# EAGLE design SSR 3.3V (EAGLE 7.2.0)
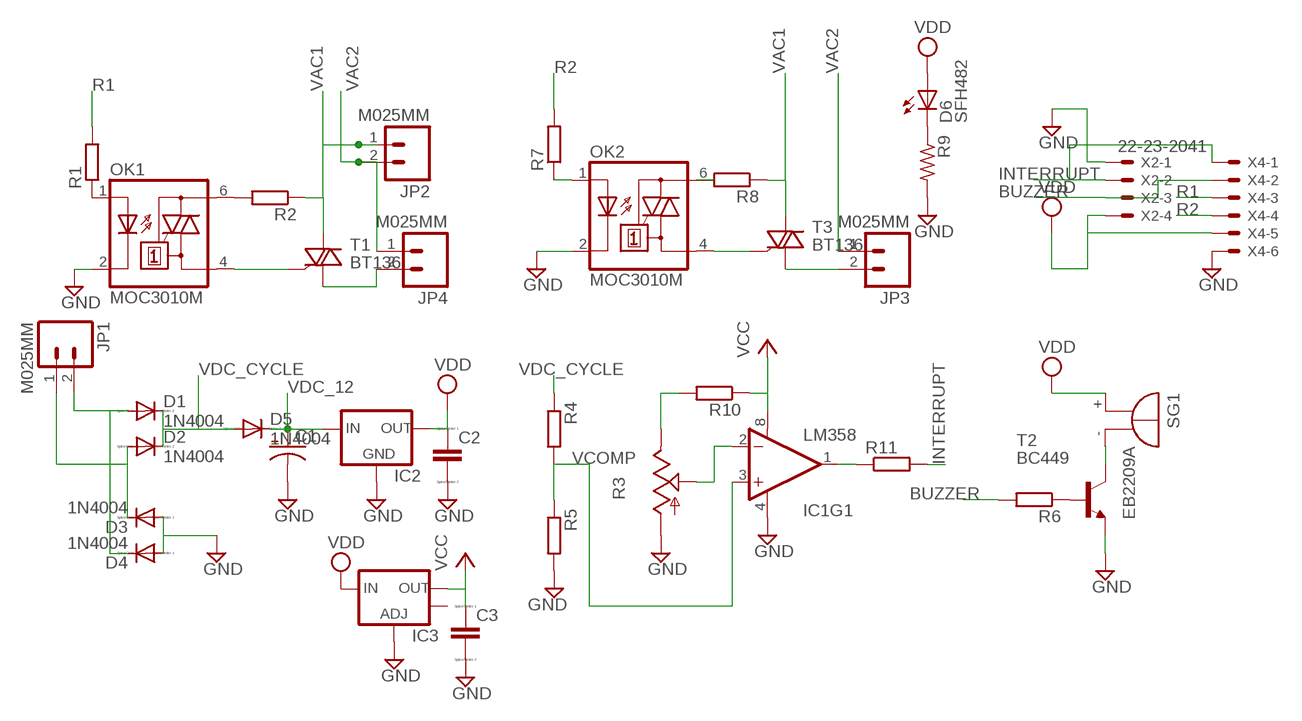
[diagram p0: schematic, sheet 1]

## Parts
C1  CPOL-USE3.5-10  [E3,5-10]
C2  CC1206  [C1206]
C3  CC1206  [C1206]
D1  1N4004  [DO41-10]
D2  1N4004  [DO41-10]
D3  1N4004  [DO41-10]
D4  1N4004  [DO41-10]
D5  1N4004  [DO41-10]
D6  SFH482  [SFH482]
IC1  LM358  [DIP08]
IC2  V_REG_78XX-TO-220  [TO-220-ALT]
IC3  V_REG_LM1117SOT223  [SOT223]
JP1  M025MM  [SCREWTERMINAL-5MM-2]
JP2  M025MM  [SCREWTERMINAL-5MM-2]
JP3  M025MM  [SCREWTERMINAL-5MM-2]
JP4  M025MM  [SCREWTERMINAL-5MM-2]
OK1  MOC3010M  [DIL06]
OK2  MOC3010M  [DIL06]
R1  R-EU_0204/7  [0204/7]
R2  R-EU_0204/7  [0204/7]
R3  TRIM_US-CA9V  [CA9V]
R4  R-EU_0207/12  [0207/12]
R5  R-EU_0204/7  [0204/7]
R6  R-EU_0204/7  [0204/7]
R7  R-EU_0204/7  [0204/7]
R8  R-EU_0204/7  [0204/7]
R9  R-US_0207/10  [0207/10]
R10  R-EU_0204/7  [0204/7]
R11  R-EU_0207/12  [0207/12]
SG1  EB2209A  [EB2209A]
T1  BT136  [TO220AB]
T2  BC449  [TO92-EBC]
T3  BT136  [TO220AB]
X2  22-23-2041  [22-23-2041]
X4  22-23-2061  [22-23-2061]

## Nets
BUZZER: R6.2 X2.3 X4.2
GND: C1.- C2.2 C3.2 D3.A D4.A IC1.4(V-) IC2.GND IC3.1(ADJ) OK1.2(C) OK2.2(C) R3.A R5.2 R9.2 T2.E X2.1 X4.6
INTERRUPT: R11.2 X2.2 X4.1
N$1: OK1.1(A) R1.1
N$2: R3.E R10.2
N$3: IC1.1(OUT) R11.1
N$4: OK1.6(A2) R2.2
N$5: IC1.2(-IN) R3.S
N$6: OK1.4(A1) T1.3(G)
N$7: R6.1 T2.B
N$8: JP4.2 T1.1(A1)
N$9: SG1.- T2.C
N$10: D6.K(C) R9.1
N$11: OK2.1(A) R7.1
N$13: OK2.6(A2) R8.2
N$14: OK2.4(A1) T3.3(G)
N$15: JP3.2 T3.1(A1)
R1: R1.2 X4.3
R2: R7.2 X4.4
VAC: D1.A D4.C JP1.2
VAC1: JP2.1 R2.1 R8.1 T1.2(A2) T3.2(A2)
VAC2: JP2.2 JP3.1 JP4.1
VAC_: D2.A D3.C JP1.1
VCC: C3.1 IC1.8(V+) IC3.2(OUT) R10.1
VCOMP: IC1.3(+IN) R4.2 R5.1
VDC_12: C1.+ D5.C IC2.IN
VDC_CYCLE: D1.C D2.C D5.A R4.1
VDD: C2.1 D6.A IC2.OUT IC3.3(IN) SG1.+ X2.4 X4.5
Unconnected: IC1.5(+IN) IC1.6(-IN) IC1.7(OUT) IC3.4(OUT)

## Library data of the parts
C1 = rcl:CPOL-US: POLARIZED CAPACITOR, American symbol
C2 C3 = eagle-ltspice:C: CAPACITOR, European symbol; SPICEMODEL: NONE; SPICEPREFIX: C
D1-D5 = diode:1N4004: DIODE general purpose rectifier, 1 A
D6 = led:SFH482: IR LED infrared emitting diode, Infineon
IC1 = SparkFun-AnalogIC:LM358: Jellybean op-amp; PROD_ID: IC-09172
IC2 = SparkFun-PowerIC:V_REG_78XX: Voltage Regulator Standard 7805 5V regulator. IGO (Input Ground Output). Spark Fun Electronics SKU : COM-00107
IC3 = SparkFun-PowerIC:V_REG_LM1117: Voltage Regulator LM1117 Standard adjustable voltage regulator but in SMD form. Spark Fun Electronics SKU : COM-00595
JP1-JP4 = SparkFun-Connectors:M02: Standard 2-pin 0.1" header. Use with - straight break away headers ( PRT-00116) - right angle break away headers (PRT-00553) - swiss pins (PRT-00743) - machine pins (PRT-00117) - female headers (PRT-00115) Molex polarized connector foot print use with: PRT-08233 with associated crimp pins and housings. 2.54_SCREWTERM for use with PRT-10571. 3.5mm Screw Terminal footprints for PRT-08084 5mm Screw Terminal footprints for use with PRT-08433
OK1 OK2 = optocoupler:MOC30*M: RANDOM-PHASE OPTOISOLATORS TRIAC DRIVER OUTPUT Source: http://www.fairchildsemi.com MOC3020-M.pdf; MF: FAIRCHILD SEMICONDUCTOR; MPN: MOC3010-M; OC_FARNELL: 1505423; OC_NEWARK: 72K8892
R1 R2 R4-R8 R10 R11 = rcl:R-EU_: RESISTOR, European symbol
R3 = pot:TRIM_US-: POTENTIOMETER
R9 = resistor:R-US_: RESISTOR, American symbol
SG1 = buzzer:EB2209A: BUZZER Source: Buerklin; OC_FARNELL: unknown; OC_NEWARK: unknown
T1 T3 = triac:BT136: Triac BT136 series E sensitive gate Source: http://www.nxp.com/acrobat_download/datasheets/BT136_SERIES_E_2.pdf
T2 = transistor-npn:BC449*: NPN Transistor
X2 = con-molex:22-23-2041: .100" (2.54mm) Center Header - 4 Pin; MF: MOLEX; MPN: 22-23-2041; OC_FARNELL: 1462920; OC_NEWARK: 38C0355
X4 = con-molex:22-23-2061: .100" (2.54mm) Center Header - 6 Pin; MF: MOLEX; MPN: 22-23-2061; OC_FARNELL: 1462922; OC_NEWARK: 27C1933

## Board
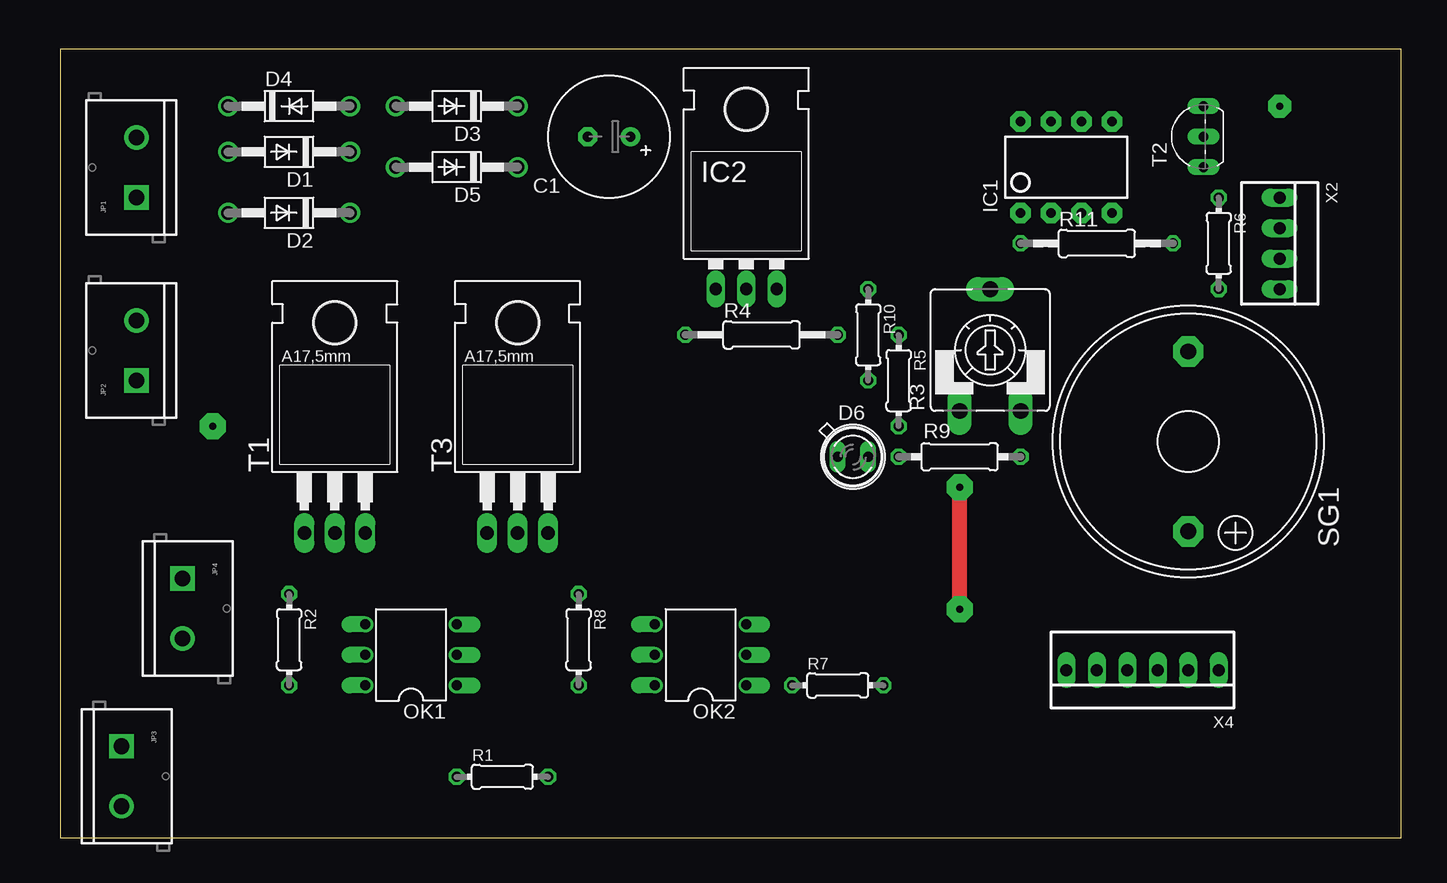
[diagram p1: board, top side]
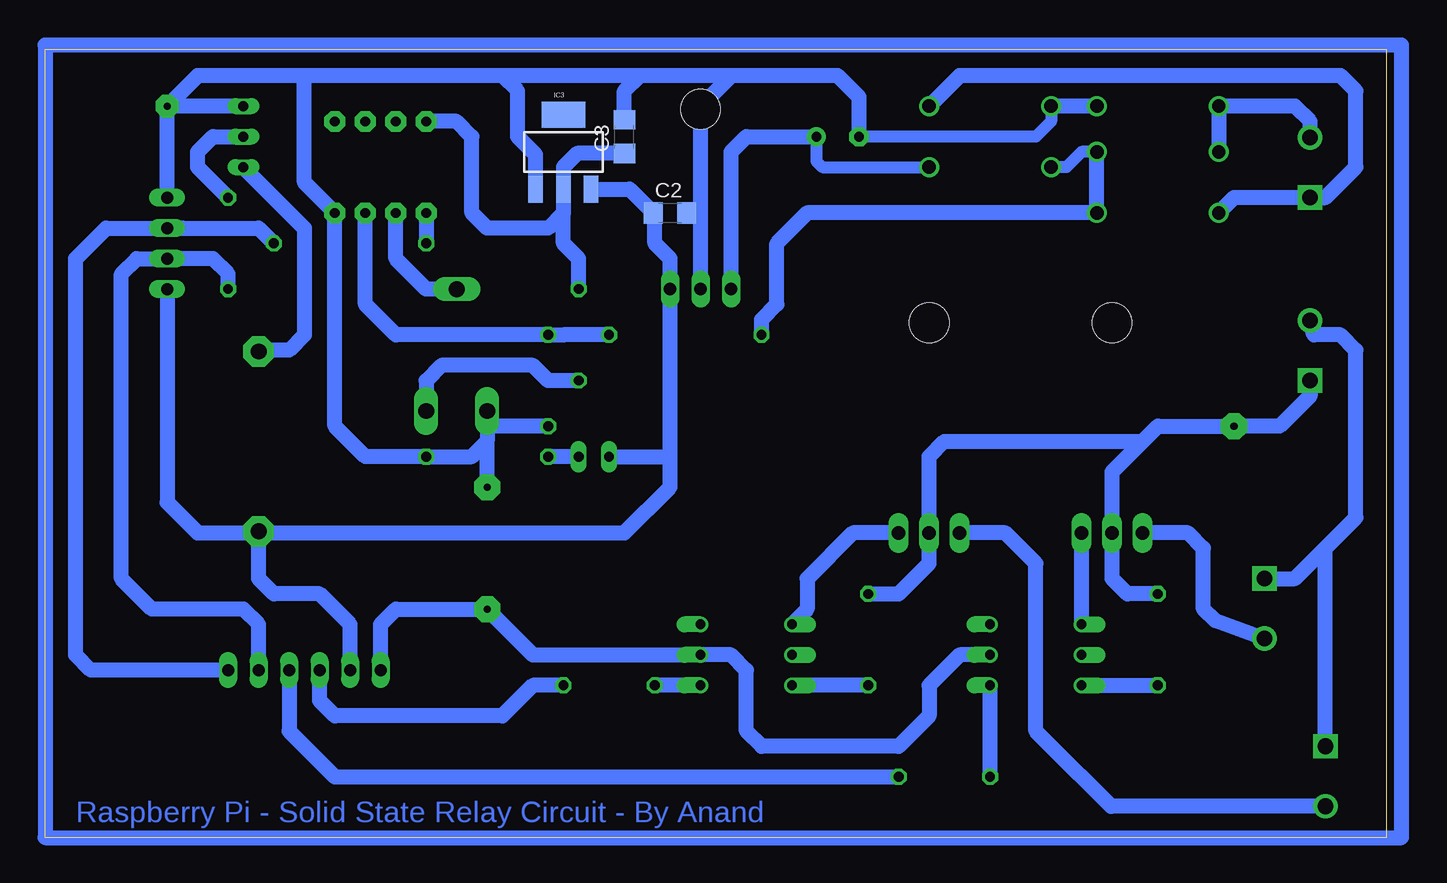
[diagram p2: board, bottom side, seen from below]

Size 111.74 x 65.71 mm. Coordinates in mm from the lower left corner, seen from the top.
Outline: 0,0 111.74,0 111.74,65.71 0,65.71 0,0
Copper layers (1*16): Top 0.035mm / dielectric 1.5mm / Bottom 0.035mm
Design rules "default": minimum track width 10mil, minimum drill 24mil, track to track 8mil, track to pad 8mil, pad to pad 8mil, via to via 8mil, smd to smd 8mil, copper to edge 40mil, drill to drill 8mil, minimum pad ring 10mil, minimum via ring 8mil, stop-mask expansion 4mil, vias tented up to drill 0mil, thermal gap 10mil

### Footprints (pad centres in the part's own frame; a part is rotated, then mirrored left to right if it is on the bottom)
E3,5-10 = drill 0.813 pad 1.6: + -1.778,0 | drill 0.813 pad 1.6 octagon: - 1.778,0
C1206 = smd 1.6 x 1.8: 1 -1.4,0; 2 1.4,0
DO41-10 = drill 1.118: A 5.08,0; C -5.08,0
SFH482 = drill 0.813 long: A -1.27,0; K 1.27,0
DIP08 = drill 0.813 pad 1.727 octagon: 1 -3.81,-3.81; 2 -1.27,-3.81; 3 1.27,-3.81; 4 3.81,-3.81; 5 3.81,3.81; 6 1.27,3.81; 7 -1.27,3.81; 8 -3.81,3.81
TO-220-ALT = drill 1.016 long: GND 0,-3.81; IN -2.54,-3.81; OUT 2.54,-3.81 | hole 3.302: 0,11.176
SOT223 = smd 1.219 x 2.235: 1 -2.311,-3.099; 2 0,-3.099; 3 2.311,-3.099 | smd 3.6 x 2.2: 4 0,3.099
SCREWTERMINAL-5MM-2 = drill 1.3 pad 2.032 square: 1 0,0 | drill 1.3 pad 2.032: 2 5,0
DIL06 = drill 0.813 offset: 1 -2.54,-3.81; 2 0,-3.81; 3 2.54,-3.81; 4 2.54,3.81; 5 0,3.81; 6 -2.54,3.81
0204/7 = drill 0.813 octagon: 1 -3.81,0; 2 3.81,0
CA9V = drill 1.321 long: A -2.54,-5.08; E 2.54,-5.08; S 0,5.08
0207/12 = drill 0.813 octagon: 1 -6.35,0; 2 6.35,0
0207/10 = drill 0.813 octagon: 1 -5.08,0; 2 5.08,0
EB2209A = drill 1.321 pad 2.54 octagon: + 7.493,0; - -7.493,0
TO220AB = drill 1.118 long: 1 -2.54,-6.35; 2 0,-6.35; 3 2.54,-6.35 | hole 3.302: 0,11.176
TO92-EBC = drill 0.813 long: B 0,-1.27; C -2.54,-1.27; E 2.54,-1.27
22-23-2041 = drill 1 long: 1 -3.81,0; 2 -1.27,0; 3 1.27,0; 4 3.81,0
22-23-2061 = drill 1 long: 1 -6.35,0; 2 -3.81,0; 3 -1.27,0; 4 1.27,0; 5 3.81,0; 6 6.35,0

### Placement (x,y rotation side)
C1  45.72,58.42 180 top
C2  59.69,52.07 0 bottom
C3  63.5,58.42 90 bottom
D1  19.05,57.15 180 top
D2  19.05,52.07 180 top
D3  33.02,60.96 180 top
D4  19.05,60.96 0 top
D5  33.02,55.88 180 top
D6  66.04,31.75 0 top
IC1  83.82,55.88 0 top
IC2  57.15,49.53 0 top
IC3  68.58,57.15 0 bottom
JP1  6.35,53.34 90 top
JP2  6.35,38.1 90 top
JP3  5.08,7.62 270 top
JP4  10.16,21.59 270 top
OK1  29.21,15.24 90 top
OK2  53.34,15.24 90 top
R1  36.83,5.08 0 top
R2  19.05,16.51 270 top
R3  77.47,40.64 0 top
R4  58.42,41.91 0 top
R5  69.85,38.1 270 top
R6  96.52,49.53 270 top
R7  64.77,12.7 0 top
R8  43.18,16.51 270 top
R9  74.93,31.75 0 top
R10  67.31,41.91 270 top
R11  86.36,49.53 0 top
SG1  93.98,33.02 270 top
T1  22.86,31.75 0 top
T2  93.98,58.42 90 top
T3  38.1,31.75 0 top
X2  101.6,49.53 270 top
X4  90.17,13.97 180 top

### Tracks (layer width: path | path; a pad name or v marks a point on that pad's centre or on a via)
BUZZER
  Bottom 1.27: R6.2 96.52,46.99 97.79,48.26 X2.3 104.14,48.26 105.41,46.99 105.41,21.59 102.87,19.05 95.25,19.05 93.98,17.78 X4.2
GND  (via drill 0.6 pad 1.93, 0.6 pad 2.18)
  Top 1.27: v74.93,19.05 v74.93,29.21
  Bottom 1.016: D3.A 27.94,59.69 29.21,58.42 C1.-
  Bottom 1.27: D4.A D3.A | C1.- 43.94,61.72 45.72,63.5 54.61,63.5 | 54.61,63.5 62.23,63.5 | 62.23,63.5 73.66,63.5 | 73.66,63.5 90.17,63.5 | 90.17,63.5 99.06,63.5 v101.6,60.96 | IC2.GND 57.15,52.07 | 57.15,52.07 57.15,60.96 54.61,63.5 | C2.2 57.15,52.07 | C3.2 63.5,62.23 62.23,63.5 | IC3.1 70.89,56.92 72.39,58.42 72.39,62.23 73.66,63.5 | R3.A 74.93,34.29 | 74.93,34.29 74.93,33.02 | 74.93,33.02 76.2,31.75 R9.2 85.09,31.75 87.63,34.29 IC1.4 90.17,54.61 90.17,63.5 | X2.1 v101.6,60.96 | T2.E v101.6,60.96 | R5.2 74.93,34.29 | v74.93,29.21 74.93,33.02 | OK1.2 35.56,15.24 38.1,12.7 38.1,10.16 40.64,7.62 52.07,7.62 53.34,8.89 53.34,13.97 54.61,15.24 OK2.2 71.12,15.24 v74.93,19.05 82.55,19.05 83.82,17.78 X4.6
INTERRUPT
  Bottom 1.27: R11.2 93.98,50.8 100.33,50.8 X2.2 106.68,50.8 109.22,48.26 109.22,15.24 107.95,13.97 X4.1
N$1
  Bottom 1.27: R1.1 OK1.1
N$2
  Bottom 1.27: R10.2 69.85,38.1 71.12,39.37 78.74,39.37 80.01,38.1 R3.E
N$3
  Bottom 1.27: IC1.1 R11.1
N$4
  Bottom 1.27: OK1.6 R2.2
N$5
  Bottom 1.27: R3.S 80.01,45.72 82.55,48.26 IC1.2
N$6
  Bottom 1.27: OK1.4 T1.3
N$7
  Bottom 1.27: R6.1 99.06,55.88 99.06,57.15 97.79,58.42 T2.B
N$8
  Bottom 1.27: JP4.2 14.28,18.09 15.24,19.05 15.24,24.13 16.51,25.4 T1.1
N$9
  Bottom 1.27: T2.C 90.17,50.8 90.17,41.91 91.44,40.64 93.85,40.64 SG1.-
N$10
  Bottom 1.27: D6.K R9.1
N$11
  Bottom 1.27: OK2.1 R7.1
N$12
  Bottom 1.27: 0,66.04 1.27,66.04 111.76,66.04 111.76,0 -1.27,0 -1.27,66.04 0,66.04
N$13
  Bottom 1.27: R8.2 OK2.6
N$14
  Bottom 1.27: T3.3 44.45,25.4 48.26,21.59 48.26,19.05 OK2.4
N$15
  Bottom 1.27: T3.1 31.75,25.4 29.21,22.86 29.21,8.89 26.67,6.35 24.44,4.12 22.94,2.62 JP3.2
R1
  Bottom 1.27: X4.3 91.44,8.89 87.63,5.08 R1.2
R2
  Bottom 1.27: R7.2 71.12,12.7 73.66,10.16 87.63,10.16 88.9,11.43 X4.4
VAC
  Bottom 1.27: JP1.2 6.35,59.69 7.62,60.96 D4.C D1.A
VAC1  (via drill 0.6 pad 2.18)
  Bottom 1.27: JP2.1 6.35,36.83 8.89,34.29 v12.7,34.29 19.05,34.29 20.32,33.02 | 20.32,33.02 22.86,30.48 T1.2 22.86,21.59 21.59,20.32 R2.1 | 20.32,33.02 36.83,33.02 38.1,31.75 T3.2 38.1,22.86 40.64,20.32 R8.1
VAC2
  Bottom 1.27: JP4.1 7.62,21.59 5.08,24.13 | JP2.2 6.04,41.91 3.81,41.91 2.54,40.64 2.54,26.67 5.08,24.13 | JP3.1 5.08,24.13
VAC_
  Bottom 1.27: D3.C 35.56,63.5 3.81,63.5 2.54,62.23 2.54,55.88 5.08,53.34 JP1.1 12.7,53.34 D2.A
VCC
  Bottom 1.27: C3.1 67.44,57.02 68.58,55.88 IC3.2 68.58,53.34 68.58,52.07 | 68.58,52.07 69.85,50.8 74.93,50.8 76.2,52.07 76.2,58.42 77.47,59.69 IC1.8 | R10.1 67.31,48.26 68.58,49.53 68.58,52.07
VCOMP
  Bottom 1.27: R4.2 68.58,41.91 R5.1 82.55,41.91 85.09,44.45 IC1.3
VDC_12
  Bottom 1.016: C1.+ 47.5,56.39 46.99,55.88 D5.C
  Bottom 1.27: IC2.IN 54.61,57.15 53.34,58.42 C1.+
VDC_CYCLE
  Bottom 1.016: D1.C 25.4,57.15 26.67,55.88 D5.A
  Bottom 1.27: D1.C D2.C 48.26,52.07 50.8,49.53 50.8,44.45 52.07,43.18 R4.1
VDD
  Bottom 1.27: IC3.3 63.07,54.05 C2.1 60.96,51.94 60.96,49.53 59.69,48.26 IC2.OUT 59.69,31.75 | X2.4 101.6,27.94 99.06,25.4 93.98,25.4 | 93.98,25.4 63.5,25.4 59.69,29.21 59.69,31.75 | 93.98,25.4 SG1.+ 93.98,21.59 92.71,20.32 88.9,20.32 86.36,17.78 X4.5 | D6.A 59.69,31.75

### Text on the board
Bottom: Raspberry Pi - Solid State Relay Circuit - By Anand